# Altium schematic sheet SX1308升压电路.SchDoc
size A4
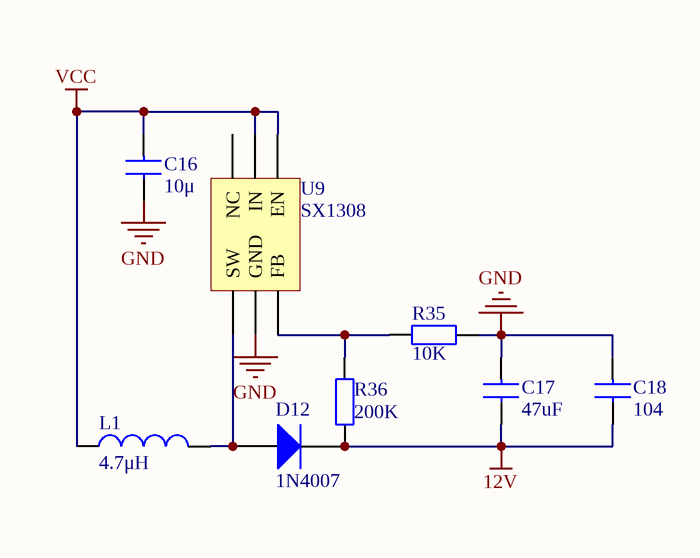
[diagram p0: SX1308升压电路.SchDoc]

## Parts
C16  10μ  [C0805]
C17  47uF  [R1206]
C18  104  [c0603]
D12  1N4007  [R0805]
L1  value 4.7μH  [CD43]  (hidden comment: Inductor)
R35  value 10K  [R0603]  (hidden comment: Res2)
R36  value 200K  [R0603]  (hidden comment: Res2)
U9  SX1308  [SOT-26]

## Nets
12V: C17.2 C18.2 D12.2(K) R36.2
GND: C16.2 C17.1 C18.1 R35.2 U9.2(GND)
VCC: C16.1 L1.1 U9.4(EN) U9.5(IN)
NetD12_1: D12.1(A) L1.2 U9.1(SW)
NetR35_1: R35.1 R36.1 U9.3(FB)

Not connected (* = marked no-connect by the designer): U9 6(NC)

## Library data of the parts
C16-C18 = CAP（0805）: Capacitor
D12 = 1N4007: 1 Amp General Purpose Rectifier; Published: 8-Jun-2000; LatestRevisionDate: 17-Jul-2002; LatestRevisionNote: Re-released for DXP Platform.; DatasheetVersion: 1998; PackageVersion: Aug-1999; PackageReference: DO-41; Publisher: Altium Limited; PackageDescription: Diode, Axial; Body 5.2 x 2.7 mm (LxDia. max), Lead Dia. 0.86 mm (max); Code_JEDEC: DO-204-AL; ComponentLink1Description: Manufacturer Link; ComponentLink1URL: http://www.fairchildsemi.com/; ComponentLink2Description: Datasheet; ComponentLink2URL: http://www.fairchildsemi.com/ds/1N%2F1N4001.pdf
L1 = Inductor: Code_IEC: 1005; Published: 8-Jun-2000; LatestRevisionDate: 29-May-2009; LatestRevisionNote: IPC-7351 Footprint Added.; PackageReference: 0402-A; Publisher: Altium Limited; PackageDescription: Chip Inductor; Code_JEITA: 0402
R35 R36 = Res2: Resistor; Published: 8-Jun-2000; LatestRevisionDate: 17-Jul-2002; LatestRevisionNote: Re-released for DXP Platform.; PackageReference: AXIAL-0.4; Publisher: Altium Limited; PackageDescription: Axial Device, Thru-Hole; 2 Leads; 0.4 in Pin Spacing